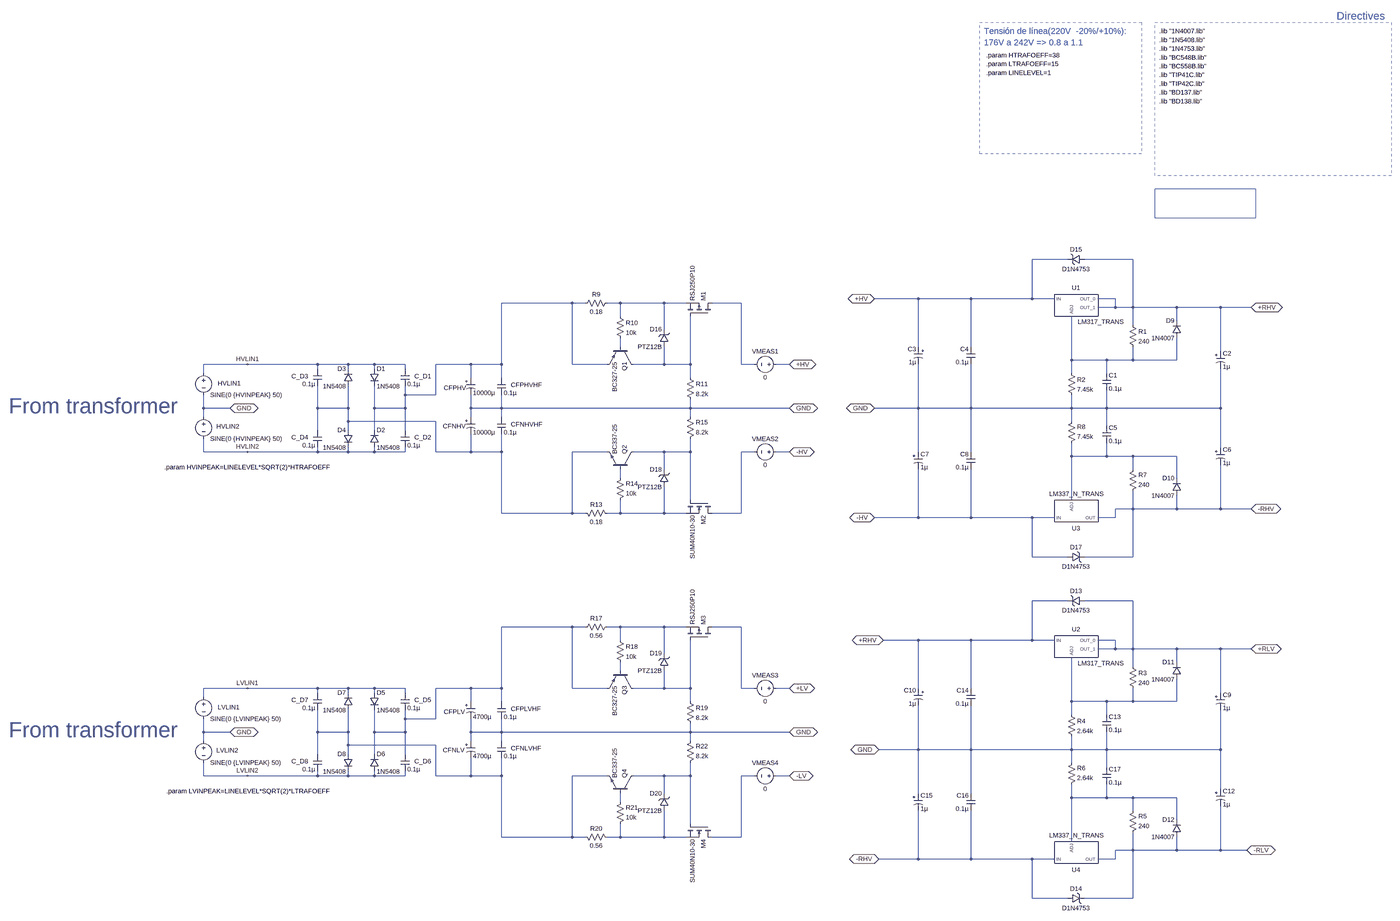
[diagram p0: schematic power_supply_V_1.0_HB_L.asc, whole sheet]
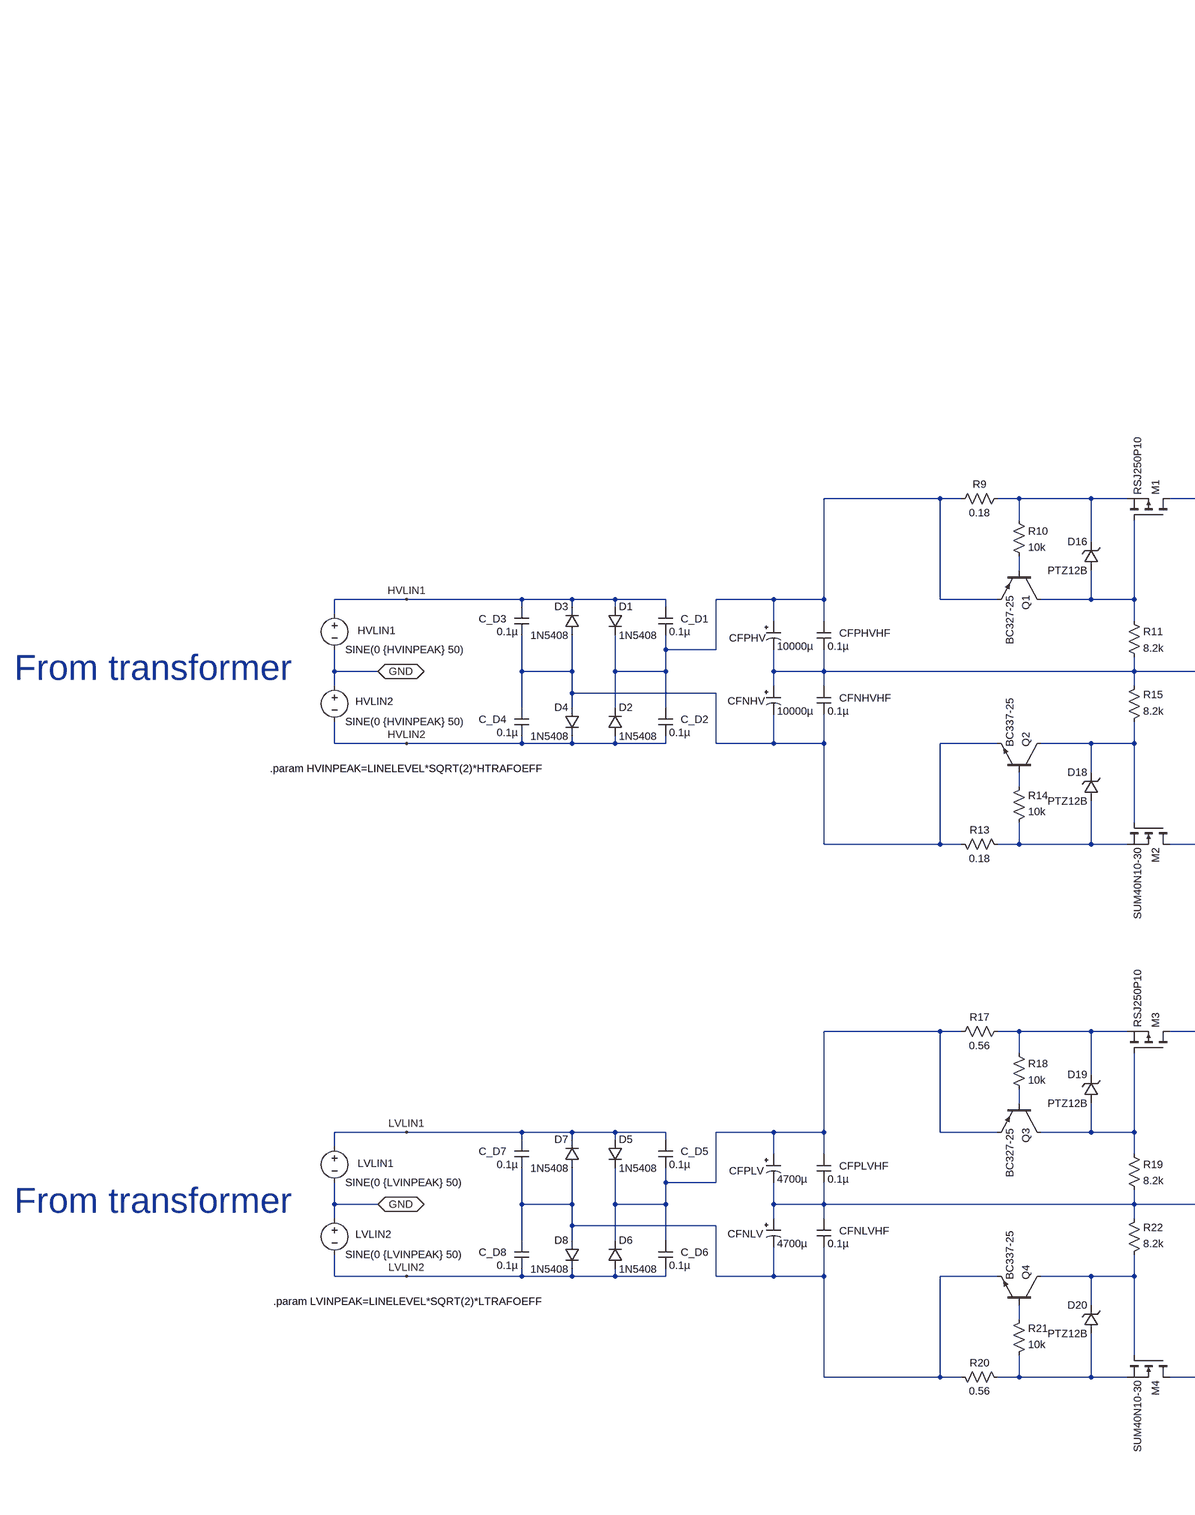
[diagram p1: schematic power_supply_V_1.0_HB_L.asc, part, row 1 of 1, column 1 of 2]
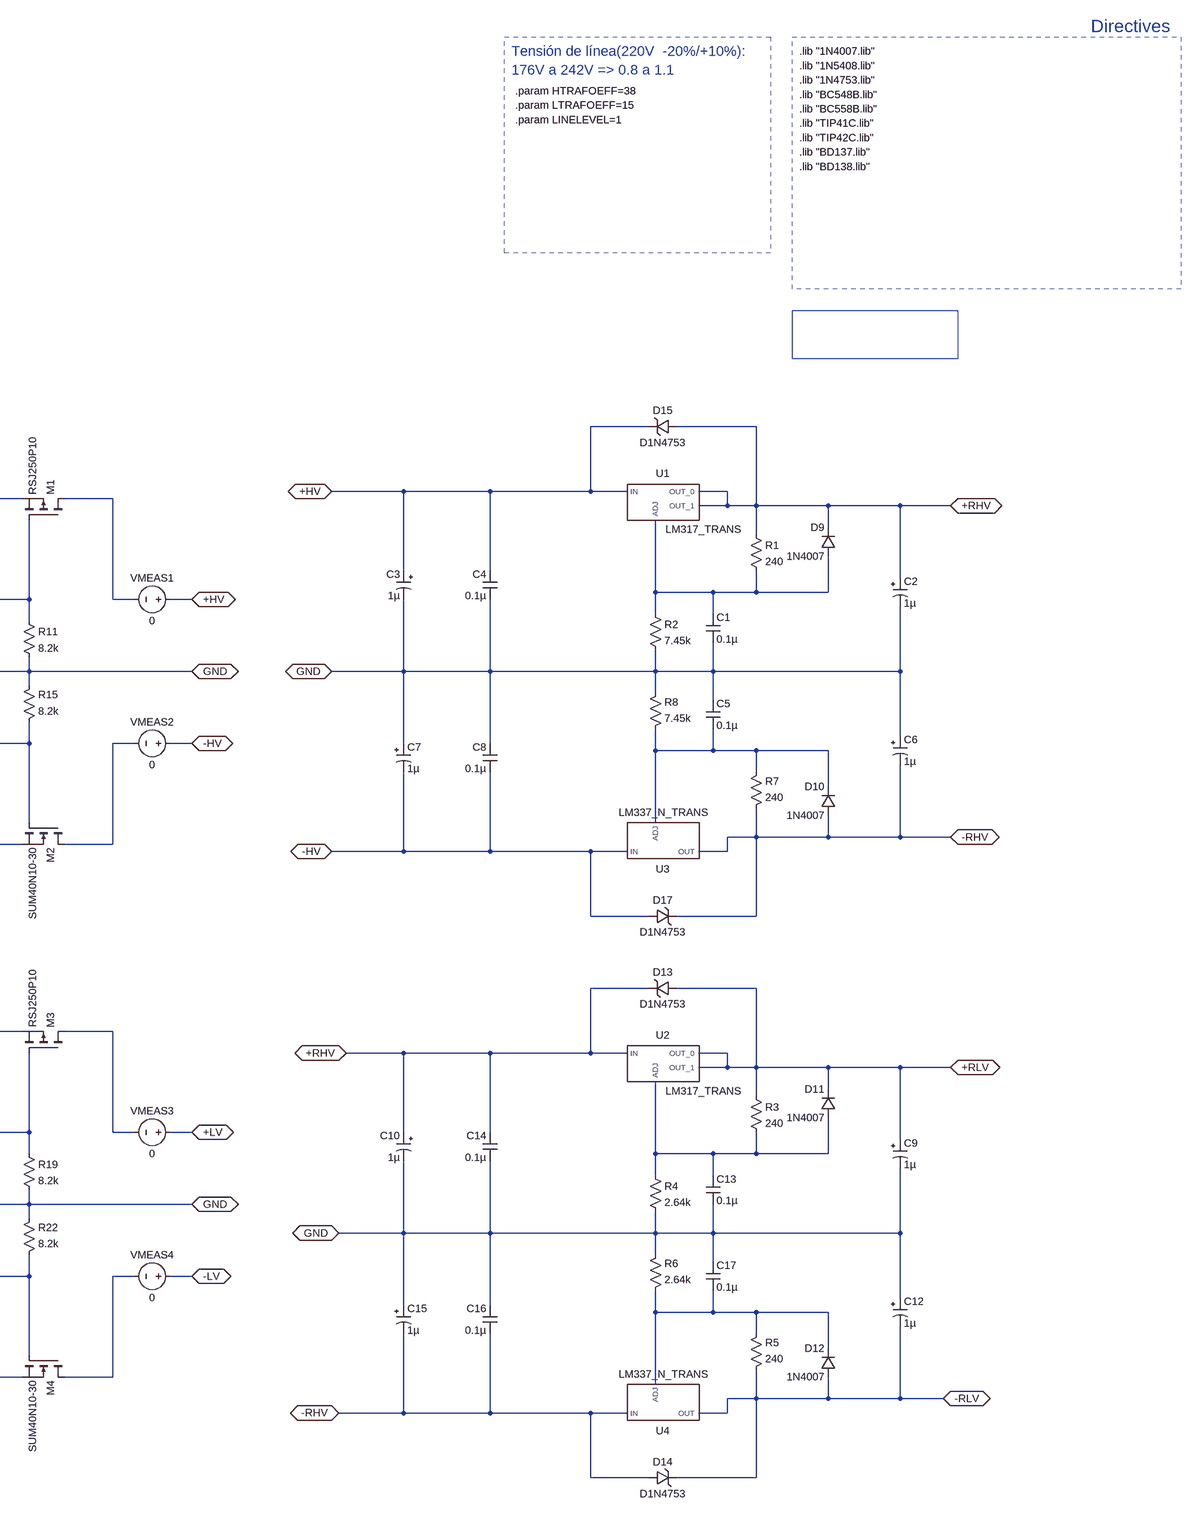
[diagram p2: schematic power_supply_V_1.0_HB_L.asc, part, row 1 of 1, column 2 of 2]
power_supply_V_1.0_HB_L.asc, the LTspice schematic file:
Version 4
SHEET 1 5728 3316
WIRE 1168 -400 1040 -400
WIRE 1408 -400 1232 -400
WIRE 624 -256 464 -256
WIRE 816 -256 624 -256
WIRE 1040 -256 1040 -400
WIRE 1040 -256 816 -256
WIRE 1120 -256 1040 -256
WIRE 1344 -256 1280 -256
WIRE -784 -240 -1072 -240
WIRE -736 -240 -784 -240
WIRE -608 -240 -656 -240
WIRE -448 -240 -608 -240
WIRE -368 -240 -448 -240
WIRE -128 -240 -272 -240
WIRE 1344 -224 1344 -256
WIRE 1344 -224 1280 -224
WIRE 1408 -224 1408 -400
WIRE 1408 -224 1344 -224
WIRE 1568 -224 1408 -224
WIRE 1728 -224 1568 -224
WIRE 1840 -224 1728 -224
WIRE -608 -192 -608 -240
WIRE 1568 -176 1568 -224
WIRE 1408 -160 1408 -224
WIRE -448 -144 -448 -240
WIRE -608 -80 -608 -112
WIRE 624 -80 624 -256
WIRE 816 -80 816 -256
WIRE 1728 -64 1728 -224
WIRE 1184 -32 1184 -192
WIRE 1312 -32 1184 -32
WIRE 1408 -32 1408 -80
WIRE 1408 -32 1312 -32
WIRE 1568 -32 1568 -112
WIRE 1568 -32 1408 -32
WIRE -2000 -16 -2160 -16
WIRE -1744 -16 -2000 -16
WIRE -1632 -16 -1744 -16
WIRE -1536 -16 -1632 -16
WIRE -1424 -16 -1536 -16
WIRE -1184 -16 -1312 -16
WIRE -1072 -16 -1072 -240
WIRE -1072 -16 -1184 -16
WIRE -784 -16 -784 -240
WIRE -656 -16 -784 -16
WIRE -448 -16 -448 -80
WIRE -448 -16 -560 -16
WIRE -352 -16 -352 -192
WIRE -352 -16 -448 -16
WIRE -128 -16 -128 -240
WIRE -80 -16 -128 -16
WIRE 48 -16 0 -16
WIRE -1744 0 -1744 -16
WIRE -1632 0 -1632 -16
WIRE -1536 0 -1536 -16
WIRE -1424 0 -1424 -16
WIRE -2160 16 -2160 -16
WIRE 1184 16 1184 -32
WIRE 1312 16 1312 -32
WIRE -1184 32 -1184 -16
WIRE -1072 32 -1072 -16
WIRE -352 32 -352 -16
WIRE -1424 96 -1424 64
WIRE -1312 96 -1312 -16
WIRE -1312 96 -1424 96
WIRE -2160 144 -2160 96
WIRE -2064 144 -2160 144
WIRE -1744 144 -1744 64
WIRE -1632 144 -1632 64
WIRE -1632 144 -1744 144
WIRE -1536 144 -1536 64
WIRE -1424 144 -1424 96
WIRE -1424 144 -1536 144
WIRE -1184 144 -1184 96
WIRE -1072 144 -1072 96
WIRE -1072 144 -1184 144
WIRE -352 144 -352 112
WIRE -352 144 -1072 144
WIRE 48 144 -352 144
WIRE 624 144 624 -16
WIRE 624 144 464 144
WIRE 816 144 816 -16
WIRE 816 144 624 144
WIRE 1184 144 1184 96
WIRE 1184 144 816 144
WIRE 1312 144 1312 80
WIRE 1312 144 1184 144
WIRE 1728 144 1728 0
WIRE 1728 144 1312 144
WIRE -2160 176 -2160 144
WIRE -1184 176 -1184 144
WIRE -1072 176 -1072 144
WIRE -352 176 -352 144
WIRE -1632 192 -1632 144
WIRE -1312 192 -1632 192
WIRE 1184 192 1184 144
WIRE 1312 208 1312 144
WIRE -1744 224 -1744 144
WIRE -1632 224 -1632 192
WIRE -1536 224 -1536 144
WIRE -1424 224 -1424 144
WIRE 1728 288 1728 144
WIRE -2160 304 -2160 256
WIRE -2000 304 -2160 304
WIRE -1744 304 -1744 288
WIRE -1744 304 -2000 304
WIRE -1632 304 -1632 288
WIRE -1632 304 -1744 304
WIRE -1536 304 -1536 288
WIRE -1536 304 -1632 304
WIRE -1424 304 -1424 288
WIRE -1424 304 -1536 304
WIRE -1312 304 -1312 192
WIRE -1184 304 -1184 240
WIRE -1184 304 -1312 304
WIRE -1072 304 -1072 240
WIRE -1072 304 -1184 304
WIRE -656 304 -784 304
WIRE -448 304 -560 304
WIRE -352 304 -352 256
WIRE -352 304 -448 304
WIRE -80 304 -128 304
WIRE 48 304 0 304
WIRE 624 304 624 144
WIRE 816 304 816 144
WIRE 1184 320 1184 272
WIRE 1312 320 1312 272
WIRE 1312 320 1184 320
WIRE 1408 320 1312 320
WIRE 1568 320 1408 320
WIRE -448 368 -448 304
WIRE 1408 368 1408 320
WIRE -608 400 -608 368
WIRE 1568 400 1568 320
WIRE -352 480 -352 304
WIRE 1184 480 1184 320
WIRE 1408 512 1408 448
WIRE 1408 512 1344 512
WIRE 1568 512 1568 464
WIRE 1568 512 1408 512
WIRE 1728 512 1728 352
WIRE 1728 512 1568 512
WIRE 1840 512 1728 512
WIRE -1072 528 -1072 304
WIRE -784 528 -784 304
WIRE -784 528 -1072 528
WIRE -736 528 -784 528
WIRE -608 528 -608 480
WIRE -608 528 -656 528
WIRE -448 528 -448 432
WIRE -448 528 -608 528
WIRE -368 528 -448 528
WIRE -128 528 -128 304
WIRE -128 528 -272 528
WIRE 624 544 624 368
WIRE 624 544 464 544
WIRE 816 544 816 368
WIRE 816 544 624 544
WIRE 1040 544 816 544
WIRE 1120 544 1040 544
WIRE 1344 544 1344 512
WIRE 1344 544 1280 544
WIRE 1040 688 1040 544
WIRE 1168 688 1040 688
WIRE 1408 688 1408 512
WIRE 1408 688 1232 688
WIRE 1168 848 1040 848
WIRE 1408 848 1232 848
WIRE -784 944 -1072 944
WIRE -736 944 -784 944
WIRE -608 944 -656 944
WIRE -448 944 -608 944
WIRE -368 944 -448 944
WIRE -128 944 -272 944
WIRE -608 992 -608 944
WIRE 624 992 496 992
WIRE 816 992 624 992
WIRE 1040 992 1040 848
WIRE 1040 992 816 992
WIRE 1120 992 1040 992
WIRE 1344 992 1280 992
WIRE 1344 1024 1344 992
WIRE 1344 1024 1280 1024
WIRE 1408 1024 1408 848
WIRE 1408 1024 1344 1024
WIRE 1568 1024 1408 1024
WIRE 1728 1024 1568 1024
WIRE 1840 1024 1728 1024
WIRE -448 1040 -448 944
WIRE 1568 1072 1568 1024
WIRE 1408 1088 1408 1024
WIRE -608 1104 -608 1072
WIRE -2000 1168 -2160 1168
WIRE -1744 1168 -2000 1168
WIRE -1632 1168 -1744 1168
WIRE -1536 1168 -1632 1168
WIRE -1424 1168 -1536 1168
WIRE -1184 1168 -1312 1168
WIRE -1072 1168 -1072 944
WIRE -1072 1168 -1184 1168
WIRE -784 1168 -784 944
WIRE -656 1168 -784 1168
WIRE -448 1168 -448 1104
WIRE -448 1168 -560 1168
WIRE -352 1168 -352 992
WIRE -352 1168 -448 1168
WIRE -128 1168 -128 944
WIRE -80 1168 -128 1168
WIRE 48 1168 0 1168
WIRE 624 1168 624 992
WIRE 816 1168 816 992
WIRE -1744 1184 -1744 1168
WIRE -1632 1184 -1632 1168
WIRE -1536 1184 -1536 1168
WIRE -1424 1184 -1424 1168
WIRE 1728 1184 1728 1024
WIRE -2160 1200 -2160 1168
WIRE -1184 1216 -1184 1168
WIRE -1072 1216 -1072 1168
WIRE -352 1216 -352 1168
WIRE 1184 1216 1184 1056
WIRE 1312 1216 1184 1216
WIRE 1408 1216 1408 1168
WIRE 1408 1216 1312 1216
WIRE 1568 1216 1568 1136
WIRE 1568 1216 1408 1216
WIRE 1184 1264 1184 1216
WIRE 1312 1264 1312 1216
WIRE -1424 1280 -1424 1248
WIRE -1312 1280 -1312 1168
WIRE -1312 1280 -1424 1280
WIRE -2160 1328 -2160 1280
WIRE -2064 1328 -2160 1328
WIRE -1744 1328 -1744 1248
WIRE -1632 1328 -1632 1248
WIRE -1632 1328 -1744 1328
WIRE -1536 1328 -1536 1248
WIRE -1424 1328 -1424 1280
WIRE -1424 1328 -1536 1328
WIRE -1184 1328 -1184 1280
WIRE -1072 1328 -1072 1280
WIRE -1072 1328 -1184 1328
WIRE -352 1328 -352 1296
WIRE -352 1328 -1072 1328
WIRE 48 1328 -352 1328
WIRE -2160 1360 -2160 1328
WIRE -1184 1360 -1184 1328
WIRE -1072 1360 -1072 1328
WIRE -352 1360 -352 1328
WIRE -1632 1376 -1632 1328
WIRE -1312 1376 -1632 1376
WIRE 624 1392 624 1232
WIRE 624 1392 480 1392
WIRE 816 1392 816 1232
WIRE 816 1392 624 1392
WIRE 1184 1392 1184 1344
WIRE 1184 1392 816 1392
WIRE 1312 1392 1312 1328
WIRE 1312 1392 1184 1392
WIRE 1728 1392 1728 1248
WIRE 1728 1392 1312 1392
WIRE -1744 1408 -1744 1328
WIRE -1632 1408 -1632 1376
WIRE -1536 1408 -1536 1328
WIRE -1424 1408 -1424 1328
WIRE 1184 1440 1184 1392
WIRE 1312 1456 1312 1392
WIRE -2160 1488 -2160 1440
WIRE -2000 1488 -2160 1488
WIRE -1744 1488 -1744 1472
WIRE -1744 1488 -2000 1488
WIRE -1632 1488 -1632 1472
WIRE -1632 1488 -1744 1488
WIRE -1536 1488 -1536 1472
WIRE -1536 1488 -1632 1488
WIRE -1424 1488 -1424 1472
WIRE -1424 1488 -1536 1488
WIRE -1312 1488 -1312 1376
WIRE -1184 1488 -1184 1424
WIRE -1184 1488 -1312 1488
WIRE -1072 1488 -1072 1424
WIRE -1072 1488 -1184 1488
WIRE -656 1488 -784 1488
WIRE -448 1488 -560 1488
WIRE -352 1488 -352 1440
WIRE -352 1488 -448 1488
WIRE -80 1488 -128 1488
WIRE 48 1488 0 1488
WIRE 1728 1536 1728 1392
WIRE -448 1552 -448 1488
WIRE 624 1552 624 1392
WIRE 816 1552 816 1392
WIRE 1184 1568 1184 1520
WIRE 1312 1568 1312 1520
WIRE 1312 1568 1184 1568
WIRE 1408 1568 1312 1568
WIRE 1568 1568 1408 1568
WIRE -608 1584 -608 1552
WIRE 1408 1616 1408 1568
WIRE 1568 1648 1568 1568
WIRE -352 1664 -352 1488
WIRE -1072 1712 -1072 1488
WIRE -784 1712 -784 1488
WIRE -784 1712 -1072 1712
WIRE -736 1712 -784 1712
WIRE -608 1712 -608 1664
WIRE -608 1712 -656 1712
WIRE -448 1712 -448 1616
WIRE -448 1712 -608 1712
WIRE -368 1712 -448 1712
WIRE -128 1712 -128 1488
WIRE -128 1712 -272 1712
WIRE 1184 1728 1184 1568
WIRE 1408 1760 1408 1696
WIRE 1408 1760 1344 1760
WIRE 1568 1760 1568 1712
WIRE 1568 1760 1408 1760
WIRE 1728 1760 1728 1600
WIRE 1728 1760 1568 1760
WIRE 1824 1760 1728 1760
WIRE 624 1792 624 1616
WIRE 624 1792 480 1792
WIRE 816 1792 816 1616
WIRE 816 1792 624 1792
WIRE 1040 1792 816 1792
WIRE 1120 1792 1040 1792
WIRE 1344 1792 1344 1760
WIRE 1344 1792 1280 1792
WIRE 1040 1936 1040 1792
WIRE 1168 1936 1040 1936
WIRE 1408 1936 1408 1760
WIRE 1408 1936 1232 1936
FLAG -2000 -16 HVLIN1
FLAG -2000 304 HVLIN2
FLAG 48 -16 +HV
IOPIN 48 -16 BiDir
FLAG 464 -256 +HV
IOPIN 464 -256 BiDir
FLAG 48 304 -HV
IOPIN 48 304 BiDir
FLAG 464 544 -HV
IOPIN 464 544 BiDir
FLAG 1840 -224 +RHV
IOPIN 1840 -224 BiDir
FLAG 1840 512 -RHV
IOPIN 1840 512 BiDir
FLAG 496 992 +RHV
IOPIN 496 992 BiDir
FLAG 480 1792 -RHV
IOPIN 480 1792 BiDir
FLAG 1840 1024 +RLV
IOPIN 1840 1024 BiDir
FLAG 1824 1760 -RLV
IOPIN 1824 1760 BiDir
FLAG -2000 1168 LVLIN1
FLAG -2000 1488 LVLIN2
FLAG 48 1168 +LV
IOPIN 48 1168 BiDir
FLAG 48 1488 -LV
IOPIN 48 1488 BiDir
FLAG -2064 144 GND
IOPIN -2064 144 BiDir
FLAG -2064 1328 GND
IOPIN -2064 1328 BiDir
FLAG 48 144 GND
IOPIN 48 144 BiDir
FLAG 48 1328 GND
IOPIN 48 1328 BiDir
FLAG 464 144 GND
IOPIN 464 144 BiDir
FLAG 480 1392 GND
IOPIN 480 1392 BiDir
SYMBOL voltage -2160 0 R0
WINDOW 123 0 0 Left 2
WINDOW 39 0 0 Left 2
WINDOW 0 51 53 Left 2
SYMATTR InstName HVLIN1
SYMATTR Value SINE(0 {HVINPEAK} 50)
SYMBOL diode -1552 0 R0
SYMATTR InstName D1
SYMATTR Value 1N5408
SYMBOL diode -1552 288 M180
WINDOW 0 24 64 Left 2
WINDOW 3 24 0 Left 2
SYMATTR InstName D2
SYMATTR Value 1N5408
SYMBOL polcap -1200 32 R0
WINDOW 0 -83 38 Left 2
WINDOW 3 24 56 Left 2
SYMATTR InstName CFPHV
SYMATTR Value 10000µ
SYMATTR Description Capacitor
SYMATTR Type cap
SYMATTR SpiceLine V=35 Irms=1.45 Rser=0.044 Lser=0 mfg="Nichicon" pn="UPR1V222MRH" type="Al electrolytic"
SYMBOL cap -1088 32 R0
WINDOW 0 50 27 Left 2
SYMATTR InstName CFPHVHF
SYMATTR Value 0.1µ
SYMATTR SpiceLine V=4 Irms=1.62 Rser=0.0464862 Lser=0 mfg="KEMET" pn="C0402C104K7PAC" type="X5R"
SYMBOL diode -1616 64 R180
WINDOW 0 24 64 Left 2
WINDOW 3 24 0 Left 2
SYMATTR InstName D3
SYMATTR Value 1N5408
SYMBOL diode -1616 224 M0
SYMATTR InstName D4
SYMATTR Value 1N5408
SYMBOL voltage -2160 160 R0
WINDOW 123 0 0 Left 2
WINDOW 39 0 0 Left 2
WINDOW 0 46 51 Left 2
SYMATTR InstName HVLIN2
SYMATTR Value SINE(0 {HVINPEAK} 50)
SYMBOL polcap -1200 176 R0
WINDOW 0 -86 34 Left 2
WINDOW 3 24 56 Left 2
SYMATTR InstName CFNHV
SYMATTR Value 10000µ
SYMATTR Description Capacitor
SYMATTR Type cap
SYMATTR SpiceLine V=35 Irms=1.45 Rser=0.044 Lser=0 mfg="Nichicon" pn="UPR1V222MRH" type="Al electrolytic"
SYMBOL cap -1088 176 R0
WINDOW 0 50 27 Left 2
SYMATTR InstName CFNHVHF
SYMATTR Value 0.1µ
SYMATTR SpiceLine V=4 Irms=1.62 Rser=0.0464862 Lser=0 mfg="KEMET" pn="C0402C104K7PAC" type="X5R"
SYMBOL LM317_TRANS 1200 -240 R0
WINDOW 3 91 53 Top 2
SYMATTR InstName U1
SYMBOL diode 1584 -112 R180
WINDOW 0 24 64 Left 2
WINDOW 3 24 0 Left 2
SYMATTR InstName D9
SYMATTR Value 1N4007
SYMBOL res 1392 -176 R0
SYMATTR InstName R1
SYMATTR Value 240
SYMBOL res 1168 0 R0
SYMATTR InstName R2
SYMATTR Value 7.45k
SYMBOL polcap 1712 -64 R0
SYMATTR InstName C2
SYMATTR Value 1µ
SYMBOL polcap 640 -80 M0
SYMATTR InstName C3
SYMATTR Value 1µ
SYMBOL diode 1584 464 R180
WINDOW 0 24 64 Left 2
WINDOW 3 24 0 Left 2
SYMATTR InstName D10
SYMATTR Value 1N4007
SYMBOL res 1392 464 M180
WINDOW 0 36 76 Left 2
WINDOW 3 36 40 Left 2
SYMATTR InstName R7
SYMATTR Value 240
SYMBOL res 1168 288 M180
WINDOW 0 36 76 Left 2
WINDOW 3 36 40 Left 2
SYMATTR InstName R8
SYMATTR Value 7.45k
SYMBOL polcap 1712 288 R0
SYMATTR InstName C6
SYMATTR Value 1µ
SYMBOL LM337_N_TRANS 1200 528 M180
SYMATTR InstName U3
SYMBOL cap 1296 16 R0
SYMATTR InstName C1
SYMATTR Value 0.1µ
SYMBOL cap 832 -80 M0
SYMATTR InstName C4
SYMATTR Value 0.1µ
SYMBOL polcap 608 304 R0
SYMATTR InstName C7
SYMATTR Value 1µ
SYMBOL cap 832 368 R180
WINDOW 0 24 56 Left 2
WINDOW 3 24 8 Left 2
SYMATTR InstName C8
SYMATTR Value 0.1µ
SYMBOL cap 1296 272 M180
WINDOW 0 24 56 Left 2
WINDOW 3 24 8 Left 2
SYMATTR InstName C5
SYMATTR Value 0.1µ
SYMBOL cap -1440 0 R0
WINDOW 0 50 27 Left 2
SYMATTR InstName C_D1
SYMATTR Value 0.1µ
SYMATTR SpiceLine V=4 Irms=1.62 Rser=0.0464862 Lser=0 mfg="KEMET" pn="C0402C104K7PAC" type="X5R"
SYMBOL cap -1440 224 R0
WINDOW 0 50 27 Left 2
SYMATTR InstName C_D2
SYMATTR Value 0.1µ
SYMATTR SpiceLine V=4 Irms=1.62 Rser=0.0464862 Lser=0 mfg="KEMET" pn="C0402C104K7PAC" type="X5R"
SYMBOL cap -1728 0 M0
WINDOW 0 50 27 Left 2
SYMATTR InstName C_D3
SYMATTR Value 0.1µ
SYMATTR SpiceLine V=4 Irms=1.62 Rser=0.0464862 Lser=0 mfg="KEMET" pn="C0402C104K7PAC" type="X5R"
SYMBOL cap -1728 224 M0
WINDOW 0 50 27 Left 2
SYMATTR InstName C_D4
SYMATTR Value 0.1µ
SYMATTR SpiceLine V=4 Irms=1.62 Rser=0.0464862 Lser=0 mfg="KEMET" pn="C0402C104K7PAC" type="X5R"
SYMBOL zener 1232 -416 R90
WINDOW 0 -4 32 VBottom 2
WINDOW 3 36 32 VTop 2
SYMATTR InstName D15
SYMATTR Value D1N4753
SYMBOL zener 1168 704 R270
WINDOW 0 36 32 VTop 2
WINDOW 3 -4 32 VBottom 2
SYMATTR InstName D17
SYMATTR Value D1N4753
SYMBOL LM317_TRANS 1200 1008 R0
WINDOW 3 91 53 Top 2
SYMATTR InstName U2
SYMBOL diode 1584 1136 R180
WINDOW 0 24 64 Left 2
WINDOW 3 24 0 Left 2
SYMATTR InstName D11
SYMATTR Value 1N4007
SYMBOL res 1392 1072 R0
SYMATTR InstName R3
SYMATTR Value 240
SYMBOL res 1168 1248 R0
SYMATTR InstName R4
SYMATTR Value 2.64k
SYMBOL polcap 1712 1184 R0
SYMATTR InstName C9
SYMATTR Value 1µ
SYMBOL polcap 640 1168 M0
SYMATTR InstName C10
SYMATTR Value 1µ
SYMBOL diode 1584 1712 R180
WINDOW 0 24 64 Left 2
WINDOW 3 24 0 Left 2
SYMATTR InstName D12
SYMATTR Value 1N4007
SYMBOL res 1392 1712 M180
WINDOW 0 36 76 Left 2
WINDOW 3 36 40 Left 2
SYMATTR InstName R5
SYMATTR Value 240
SYMBOL res 1168 1536 M180
WINDOW 0 36 76 Left 2
WINDOW 3 36 40 Left 2
SYMATTR InstName R6
SYMATTR Value 2.64k
SYMBOL polcap 1712 1536 R0
SYMATTR InstName C12
SYMATTR Value 1µ
SYMBOL LM337_N_TRANS 1200 1776 M180
SYMATTR InstName U4
SYMBOL cap 1296 1264 R0
SYMATTR InstName C13
SYMATTR Value 0.1µ
SYMBOL cap 832 1168 M0
SYMATTR InstName C14
SYMATTR Value 0.1µ
SYMBOL polcap 608 1552 R0
SYMATTR InstName C15
SYMATTR Value 1µ
SYMBOL cap 832 1616 R180
WINDOW 0 24 56 Left 2
WINDOW 3 24 8 Left 2
SYMATTR InstName C16
SYMATTR Value 0.1µ
SYMBOL cap 1296 1520 M180
WINDOW 0 24 56 Left 2
WINDOW 3 24 8 Left 2
SYMATTR InstName C17
SYMATTR Value 0.1µ
SYMBOL zener 1232 832 R90
WINDOW 0 -4 32 VBottom 2
WINDOW 3 36 32 VTop 2
SYMATTR InstName D13
SYMATTR Value D1N4753
SYMBOL zener 1168 1952 R270
WINDOW 0 36 32 VTop 2
WINDOW 3 -4 32 VBottom 2
SYMATTR InstName D14
SYMATTR Value D1N4753
SYMBOL voltage -2160 1184 R0
WINDOW 123 0 0 Left 2
WINDOW 39 0 0 Left 2
WINDOW 0 51 53 Left 2
SYMATTR InstName LVLIN1
SYMATTR Value SINE(0 {LVINPEAK} 50)
SYMBOL diode -1552 1184 R0
SYMATTR InstName D5
SYMATTR Value 1N5408
SYMBOL diode -1552 1472 M180
WINDOW 0 24 64 Left 2
WINDOW 3 24 0 Left 2
SYMATTR InstName D6
SYMATTR Value 1N5408
SYMBOL polcap -1200 1216 R0
WINDOW 0 -83 38 Left 2
WINDOW 3 24 56 Left 2
SYMATTR InstName CFPLV
SYMATTR Value 4700µ
SYMATTR Description Capacitor
SYMATTR Type cap
SYMATTR SpiceLine V=35 Irms=1.45 Rser=0.044 Lser=0 mfg="Nichicon" pn="UPR1V222MRH" type="Al electrolytic"
SYMBOL cap -1088 1216 R0
WINDOW 0 50 27 Left 2
SYMATTR InstName CFPLVHF
SYMATTR Value 0.1µ
SYMATTR SpiceLine V=4 Irms=1.62 Rser=0.0464862 Lser=0 mfg="KEMET" pn="C0402C104K7PAC" type="X5R"
SYMBOL diode -1616 1248 R180
WINDOW 0 24 64 Left 2
WINDOW 3 24 0 Left 2
SYMATTR InstName D7
SYMATTR Value 1N5408
SYMBOL diode -1616 1408 M0
SYMATTR InstName D8
SYMATTR Value 1N5408
SYMBOL voltage -2160 1344 R0
WINDOW 123 0 0 Left 2
WINDOW 39 0 0 Left 2
WINDOW 0 46 51 Left 2
SYMATTR InstName LVLIN2
SYMATTR Value SINE(0 {LVINPEAK} 50)
SYMBOL polcap -1200 1360 R0
WINDOW 0 -86 34 Left 2
WINDOW 3 24 56 Left 2
SYMATTR InstName CFNLV
SYMATTR Value 4700µ
SYMATTR Description Capacitor
SYMATTR Type cap
SYMATTR SpiceLine V=35 Irms=1.45 Rser=0.044 Lser=0 mfg="Nichicon" pn="UPR1V222MRH" type="Al electrolytic"
SYMBOL cap -1088 1360 R0
WINDOW 0 50 27 Left 2
SYMATTR InstName CFNLVHF
SYMATTR Value 0.1µ
SYMATTR SpiceLine V=4 Irms=1.62 Rser=0.0464862 Lser=0 mfg="KEMET" pn="C0402C104K7PAC" type="X5R"
SYMBOL cap -1440 1184 R0
WINDOW 0 50 27 Left 2
SYMATTR InstName C_D5
SYMATTR Value 0.1µ
SYMATTR SpiceLine V=4 Irms=1.62 Rser=0.0464862 Lser=0 mfg="KEMET" pn="C0402C104K7PAC" type="X5R"
SYMBOL cap -1440 1408 R0
WINDOW 0 50 27 Left 2
SYMATTR InstName C_D6
SYMATTR Value 0.1µ
SYMATTR SpiceLine V=4 Irms=1.62 Rser=0.0464862 Lser=0 mfg="KEMET" pn="C0402C104K7PAC" type="X5R"
SYMBOL cap -1728 1184 M0
WINDOW 0 50 27 Left 2
SYMATTR InstName C_D7
SYMATTR Value 0.1µ
SYMATTR SpiceLine V=4 Irms=1.62 Rser=0.0464862 Lser=0 mfg="KEMET" pn="C0402C104K7PAC" type="X5R"
SYMBOL cap -1728 1408 M0
WINDOW 0 50 27 Left 2
SYMATTR InstName C_D8
SYMATTR Value 0.1µ
SYMATTR SpiceLine V=4 Irms=1.62 Rser=0.0464862 Lser=0 mfg="KEMET" pn="C0402C104K7PAC" type="X5R"
SYMBOL voltage 16 -16 R90
WINDOW 0 -32 56 VBottom 2
WINDOW 3 32 56 VTop 2
SYMATTR InstName VMEAS1
SYMATTR Value 0
SYMBOL voltage 16 304 R90
WINDOW 0 -32 56 VBottom 2
WINDOW 3 32 56 VTop 2
SYMATTR InstName VMEAS2
SYMATTR Value 0
SYMBOL voltage 16 1168 R90
WINDOW 0 -32 56 VBottom 2
WINDOW 3 32 56 VTop 2
SYMATTR InstName VMEAS3
SYMATTR Value 0
SYMBOL voltage 16 1488 R90
WINDOW 0 -32 56 VBottom 2
WINDOW 3 32 56 VTop 2
SYMATTR InstName VMEAS4
SYMATTR Value 0
SYMBOL pnp -560 -80 R90
SYMATTR InstName Q1
SYMATTR Value BC327-25
SYMBOL res -640 -256 R90
WINDOW 0 0 56 VBottom 2
WINDOW 3 32 56 VTop 2
SYMATTR InstName R9
SYMATTR Value 0.18
SYMBOL res -624 -208 R0
SYMATTR InstName R10
SYMATTR Value 10k
SYMBOL res -368 16 R0
SYMATTR InstName R11
SYMATTR Value 8.2k
SYMBOL zener -432 -80 R180
WINDOW 0 24 64 Left 2
WINDOW 3 24 0 Left 2
SYMATTR InstName D16
SYMATTR Value PTZ12B
SYMBOL res -640 544 M270
WINDOW 0 32 56 VTop 2
WINDOW 3 0 56 VBottom 2
SYMATTR InstName R13
SYMATTR Value 0.18
SYMBOL res -624 496 M180
WINDOW 0 36 76 Left 2
WINDOW 3 36 40 Left 2
SYMATTR InstName R14
SYMATTR Value 10k
SYMBOL res -368 272 M180
WINDOW 0 36 76 Left 2
WINDOW 3 36 40 Left 2
SYMATTR InstName R15
SYMATTR Value 8.2k
SYMBOL zener -432 432 R180
WINDOW 0 24 64 Left 2
WINDOW 3 24 0 Left 2
SYMATTR InstName D18
SYMATTR Value PTZ12B
SYMBOL npn -560 368 M270
SYMATTR InstName Q2
SYMATTR Value BC337-25
SYMBOL pmos -272 -192 M270
SYMATTR InstName M1
SYMATTR Value RSJ250P10
SYMBOL nmos -272 480 R90
SYMATTR InstName M2
SYMATTR Value SUM40N10-30
SYMBOL pnp -560 1104 R90
SYMATTR InstName Q3
SYMATTR Value BC327-25
SYMBOL res -640 928 R90
WINDOW 0 0 56 VBottom 2
WINDOW 3 32 56 VTop 2
SYMATTR InstName R17
SYMATTR Value 0.56
SYMBOL res -624 976 R0
SYMATTR InstName R18
SYMATTR Value 10k
SYMBOL res -368 1200 R0
SYMATTR InstName R19
SYMATTR Value 8.2k
SYMBOL zener -432 1104 R180
WINDOW 0 24 64 Left 2
WINDOW 3 24 0 Left 2
SYMATTR InstName D19
SYMATTR Value PTZ12B
SYMBOL res -640 1728 M270
WINDOW 0 32 56 VTop 2
WINDOW 3 0 56 VBottom 2
SYMATTR InstName R20
SYMATTR Value 0.56
SYMBOL res -624 1680 M180
WINDOW 0 36 76 Left 2
WINDOW 3 36 40 Left 2
SYMATTR InstName R21
SYMATTR Value 10k
SYMBOL res -368 1456 M180
WINDOW 0 36 76 Left 2
WINDOW 3 36 40 Left 2
SYMATTR InstName R22
SYMATTR Value 8.2k
SYMBOL zener -432 1616 R180
WINDOW 0 24 64 Left 2
WINDOW 3 24 0 Left 2
SYMATTR InstName D20
SYMATTR Value PTZ12B
SYMBOL npn -560 1552 M270
SYMATTR InstName Q4
SYMATTR Value BC337-25
SYMBOL pmos -272 992 M270
SYMATTR InstName M3
SYMATTR Value RSJ250P10
SYMBOL nmos -272 1664 R90
SYMATTR InstName M4
SYMATTR Value SUM40N10-30
TEXT -2872 136 Left 6 ;From transformer
TEXT 1504 -1344 Left 2 !.lib "1N4007.lib"
TEXT 2152 -1400 Left 4 ;Directives
TEXT 1504 -1312 Left 2 !.lib "1N5408.lib"
TEXT 1504 -1280 Left 2 !.lib "1N4753.lib"
TEXT 872 -1256 Left 2 !.param HTRAFOEFF=38
TEXT 872 -1224 Left 2 !.param LTRAFOEFF=15
TEXT 872 -1192 Left 2 !.param LINELEVEL=1
TEXT 864 -1344 Left 3 ;Tensión de línea(220V  -20%/+10%):\n176V a 242V => 0.8 a 1.1
TEXT -2304 360 Left 2 !.param HVINPEAK=LINELEVEL*SQRT(2)*HTRAFOEFF
TEXT -2296 1544 Left 2 !.param LVINPEAK=LINELEVEL*SQRT(2)*LTRAFOEFF
TEXT 1504 -1248 Left 2 !.lib "BC548B.lib"
TEXT 1504 -1216 Left 2 !.lib "BC558B.lib"
TEXT 1504 -1184 Left 2 !.lib "TIP41C.lib"
TEXT 1504 -1152 Left 2 !.lib "TIP42C.lib"
TEXT -2872 1320 Left 6 ;From transformer
TEXT 1504 -1120 Left 2 !.lib "BD137.lib"
TEXT 1504 -1088 Left 2 !.lib "BD138.lib"
RECTANGLE Normal 2352 -816 1488 -1376 3
RECTANGLE Normal 1440 -896 848 -1376 2
RECTANGLE Normal 1856 -608 1488 -768

The netlist it stands for:
* power_supply_V_1.0_HB_L.asc
V§HVLIN1 HVLIN1 GND SINE(0 {HVINPEAK} 50)
D1 HVLIN1 N001 1N5408
D2 HVLIN2 N001 1N5408
CFPHV N001 GND 10000µ V=35 Irms=1.45 Rser=0.044 Lser=0 mfg="Nichicon" pn="UPR1V222MRH" type="Al electrolytic"
CFPHVHF N001 GND 0.1µ V=4 Irms=1.62 Rser=0.0464862 Lser=0 mfg="KEMET" pn="C0402C104K7PAC" type="X5R"
D3 N007 HVLIN1 1N5408
D4 N007 HVLIN2 1N5408
V§HVLIN2 GND HVLIN2 SINE(0 {HVINPEAK} 50)
CFNHV GND N007 10000µ V=35 Irms=1.45 Rser=0.044 Lser=0 mfg="Nichicon" pn="UPR1V222MRH" type="Al electrolytic"
CFNHVHF GND N007 0.1µ V=4 Irms=1.62 Rser=0.0464862 Lser=0 mfg="KEMET" pn="C0402C104K7PAC" type="X5R"
XU1 +HV N005 +RHV +RHV LM317_TRANS  ; pins IN ADJ OUT_0 OUT_1
D9 N005 +RHV 1N4007
R1 +RHV N005 240
R2 N005 GND 7.45k
C2 +RHV GND 1µ
C3 +HV GND 1µ
D10 -RHV N010 1N4007
R7 -RHV N010 240
R8 N010 GND 7.45k
C6 GND -RHV 1µ
XU3 -HV N010 -RHV LM337_N_TRANS  ; pins IN ADJ OUT
C1 N005 GND 0.1µ
C4 +HV GND 0.1µ
C7 GND -HV 1µ
C8 -HV GND 0.1µ
C5 N010 GND 0.1µ
C_D1 HVLIN1 N001 0.1µ V=4 Irms=1.62 Rser=0.0464862 Lser=0 mfg="KEMET" pn="C0402C104K7PAC" type="X5R"
C_D2 N001 HVLIN2 0.1µ V=4 Irms=1.62 Rser=0.0464862 Lser=0 mfg="KEMET" pn="C0402C104K7PAC" type="X5R"
C_D3 HVLIN1 N007 0.1µ V=4 Irms=1.62 Rser=0.0464862 Lser=0 mfg="KEMET" pn="C0402C104K7PAC" type="X5R"
C_D4 N007 HVLIN2 0.1µ V=4 Irms=1.62 Rser=0.0464862 Lser=0 mfg="KEMET" pn="C0402C104K7PAC" type="X5R"
D15 +RHV +HV D1N4753
D17 -HV -RHV D1N4753
XU2 +RHV N018 +RLV +RLV LM317_TRANS  ; pins IN ADJ OUT_0 OUT_1
D11 N018 +RLV 1N4007
R3 +RLV N018 240
R4 N018 GND 2.64k
C9 +RLV GND 1µ
C10 +RHV GND 1µ
D12 -RLV N022 1N4007
R5 -RLV N022 240
R6 N022 GND 2.64k
C12 GND -RLV 1µ
XU4 -RHV N022 -RLV LM337_N_TRANS  ; pins IN ADJ OUT
C13 N018 GND 0.1µ
C14 +RHV GND 0.1µ
C15 GND -RHV 1µ
C16 -RHV GND 0.1µ
C17 N022 GND 0.1µ
D13 +RLV +RHV D1N4753
D14 -RHV -RLV D1N4753
V§LVLIN1 LVLIN1 GND SINE(0 {LVINPEAK} 50)
D5 LVLIN1 N013 1N5408
D6 LVLIN2 N013 1N5408
CFPLV N013 GND 4700µ V=35 Irms=1.45 Rser=0.044 Lser=0 mfg="Nichicon" pn="UPR1V222MRH" type="Al electrolytic"
CFPLVHF N013 GND 0.1µ V=4 Irms=1.62 Rser=0.0464862 Lser=0 mfg="KEMET" pn="C0402C104K7PAC" type="X5R"
D7 N019 LVLIN1 1N5408
D8 N019 LVLIN2 1N5408
V§LVLIN2 GND LVLIN2 SINE(0 {LVINPEAK} 50)
CFNLV GND N019 4700µ V=35 Irms=1.45 Rser=0.044 Lser=0 mfg="Nichicon" pn="UPR1V222MRH" type="Al electrolytic"
CFNLVHF GND N019 0.1µ V=4 Irms=1.62 Rser=0.0464862 Lser=0 mfg="KEMET" pn="C0402C104K7PAC" type="X5R"
C_D5 LVLIN1 N013 0.1µ V=4 Irms=1.62 Rser=0.0464862 Lser=0 mfg="KEMET" pn="C0402C104K7PAC" type="X5R"
C_D6 N013 LVLIN2 0.1µ V=4 Irms=1.62 Rser=0.0464862 Lser=0 mfg="KEMET" pn="C0402C104K7PAC" type="X5R"
C_D7 LVLIN1 N019 0.1µ V=4 Irms=1.62 Rser=0.0464862 Lser=0 mfg="KEMET" pn="C0402C104K7PAC" type="X5R"
C_D8 N019 LVLIN2 0.1µ V=4 Irms=1.62 Rser=0.0464862 Lser=0 mfg="KEMET" pn="C0402C104K7PAC" type="X5R"
VMEAS1 +HV N003 0
VMEAS2 -HV N009 0
VMEAS3 +LV N015 0
VMEAS4 -LV N021 0
Q1 N006 N004 N001 0 BC327-25
R9 N002 N001 0.18
R10 N002 N004 10k
R11 N006 GND 8.2k
D16 N006 N002 PTZ12B
R13 N012 N007 0.18
R14 N012 N011 10k
R15 N008 GND 8.2k
D18 N012 N008 PTZ12B
Q2 N008 N011 N007 0 BC337-25
M1 N003 N006 N002 N002 RSJ250P10
M2 N009 N008 N012 N012 SUM40N10-30
Q3 N017 N016 N013 0 BC327-25
R17 N014 N013 0.56
R18 N014 N016 10k
R19 N017 GND 8.2k
D19 N017 N014 PTZ12B
R20 N024 N019 0.56
R21 N024 N023 10k
R22 N020 GND 8.2k
D20 N024 N020 PTZ12B
Q4 N020 N023 N019 0 BC337-25
M3 N015 N017 N014 N014 RSJ250P10
M4 N021 N020 N024 N024 SUM40N10-30
.model D D
.lib standard.dio
.model NPN NPN
.model PNP PNP
.lib standard.bjt
.model NMOS NMOS
.model PMOS PMOS
.lib standard.mos
* From transformer
.lib "1N4007.lib"
* Directives
.lib "1N5408.lib"
.lib "1N4753.lib"
.param HTRAFOEFF=38
.param LTRAFOEFF=15
.param LINELEVEL=1
* Tensión de línea(220V  -20%/+10%):
* 176V a 242V => 0.8 a 1.1
.param HVINPEAK=LINELEVEL*SQRT(2)*HTRAFOEFF
.param LVINPEAK=LINELEVEL*SQRT(2)*LTRAFOEFF
.lib "BC548B.lib"
.lib "BC558B.lib"
.lib "TIP41C.lib"
.lib "TIP42C.lib"
* From transformer
.lib "BD137.lib"
.lib "BD138.lib"
.lib LM317_TRANS.LIB
.lib LM337_N_TRANS.LIB
.backanno
.end